# Altium schematic sheet [PCICARD]-PCI-PADS-Ax-Bx.SchDoc: Connector PCI Socket
size A3; Organization: Toradex AG; Address1: Altsagenstrasse 5; Address2: Horw; Address3: 6048; Address4: Switzerland; DocumentNumber: 6; Revision: V3.2; SheetNumber: 6; SheetTotal: 14; PageSetup: Record=PageOptions|CenterHorizontal=True|CenterVertical=True|PrintScale=0.73|XCorrection=1.00|YCorrection=1.00|PrintKind=0|BorderSize=5000000|LeftOffset=0|BottomOffset=0|Orientation=2|PaperLength=1000|PaperWidth=1000|Scale=100|PaperSource=7|PrintQuality=600|MediaType=1|DitherType=10|PaperKind=A4|PrintScaleMode=1
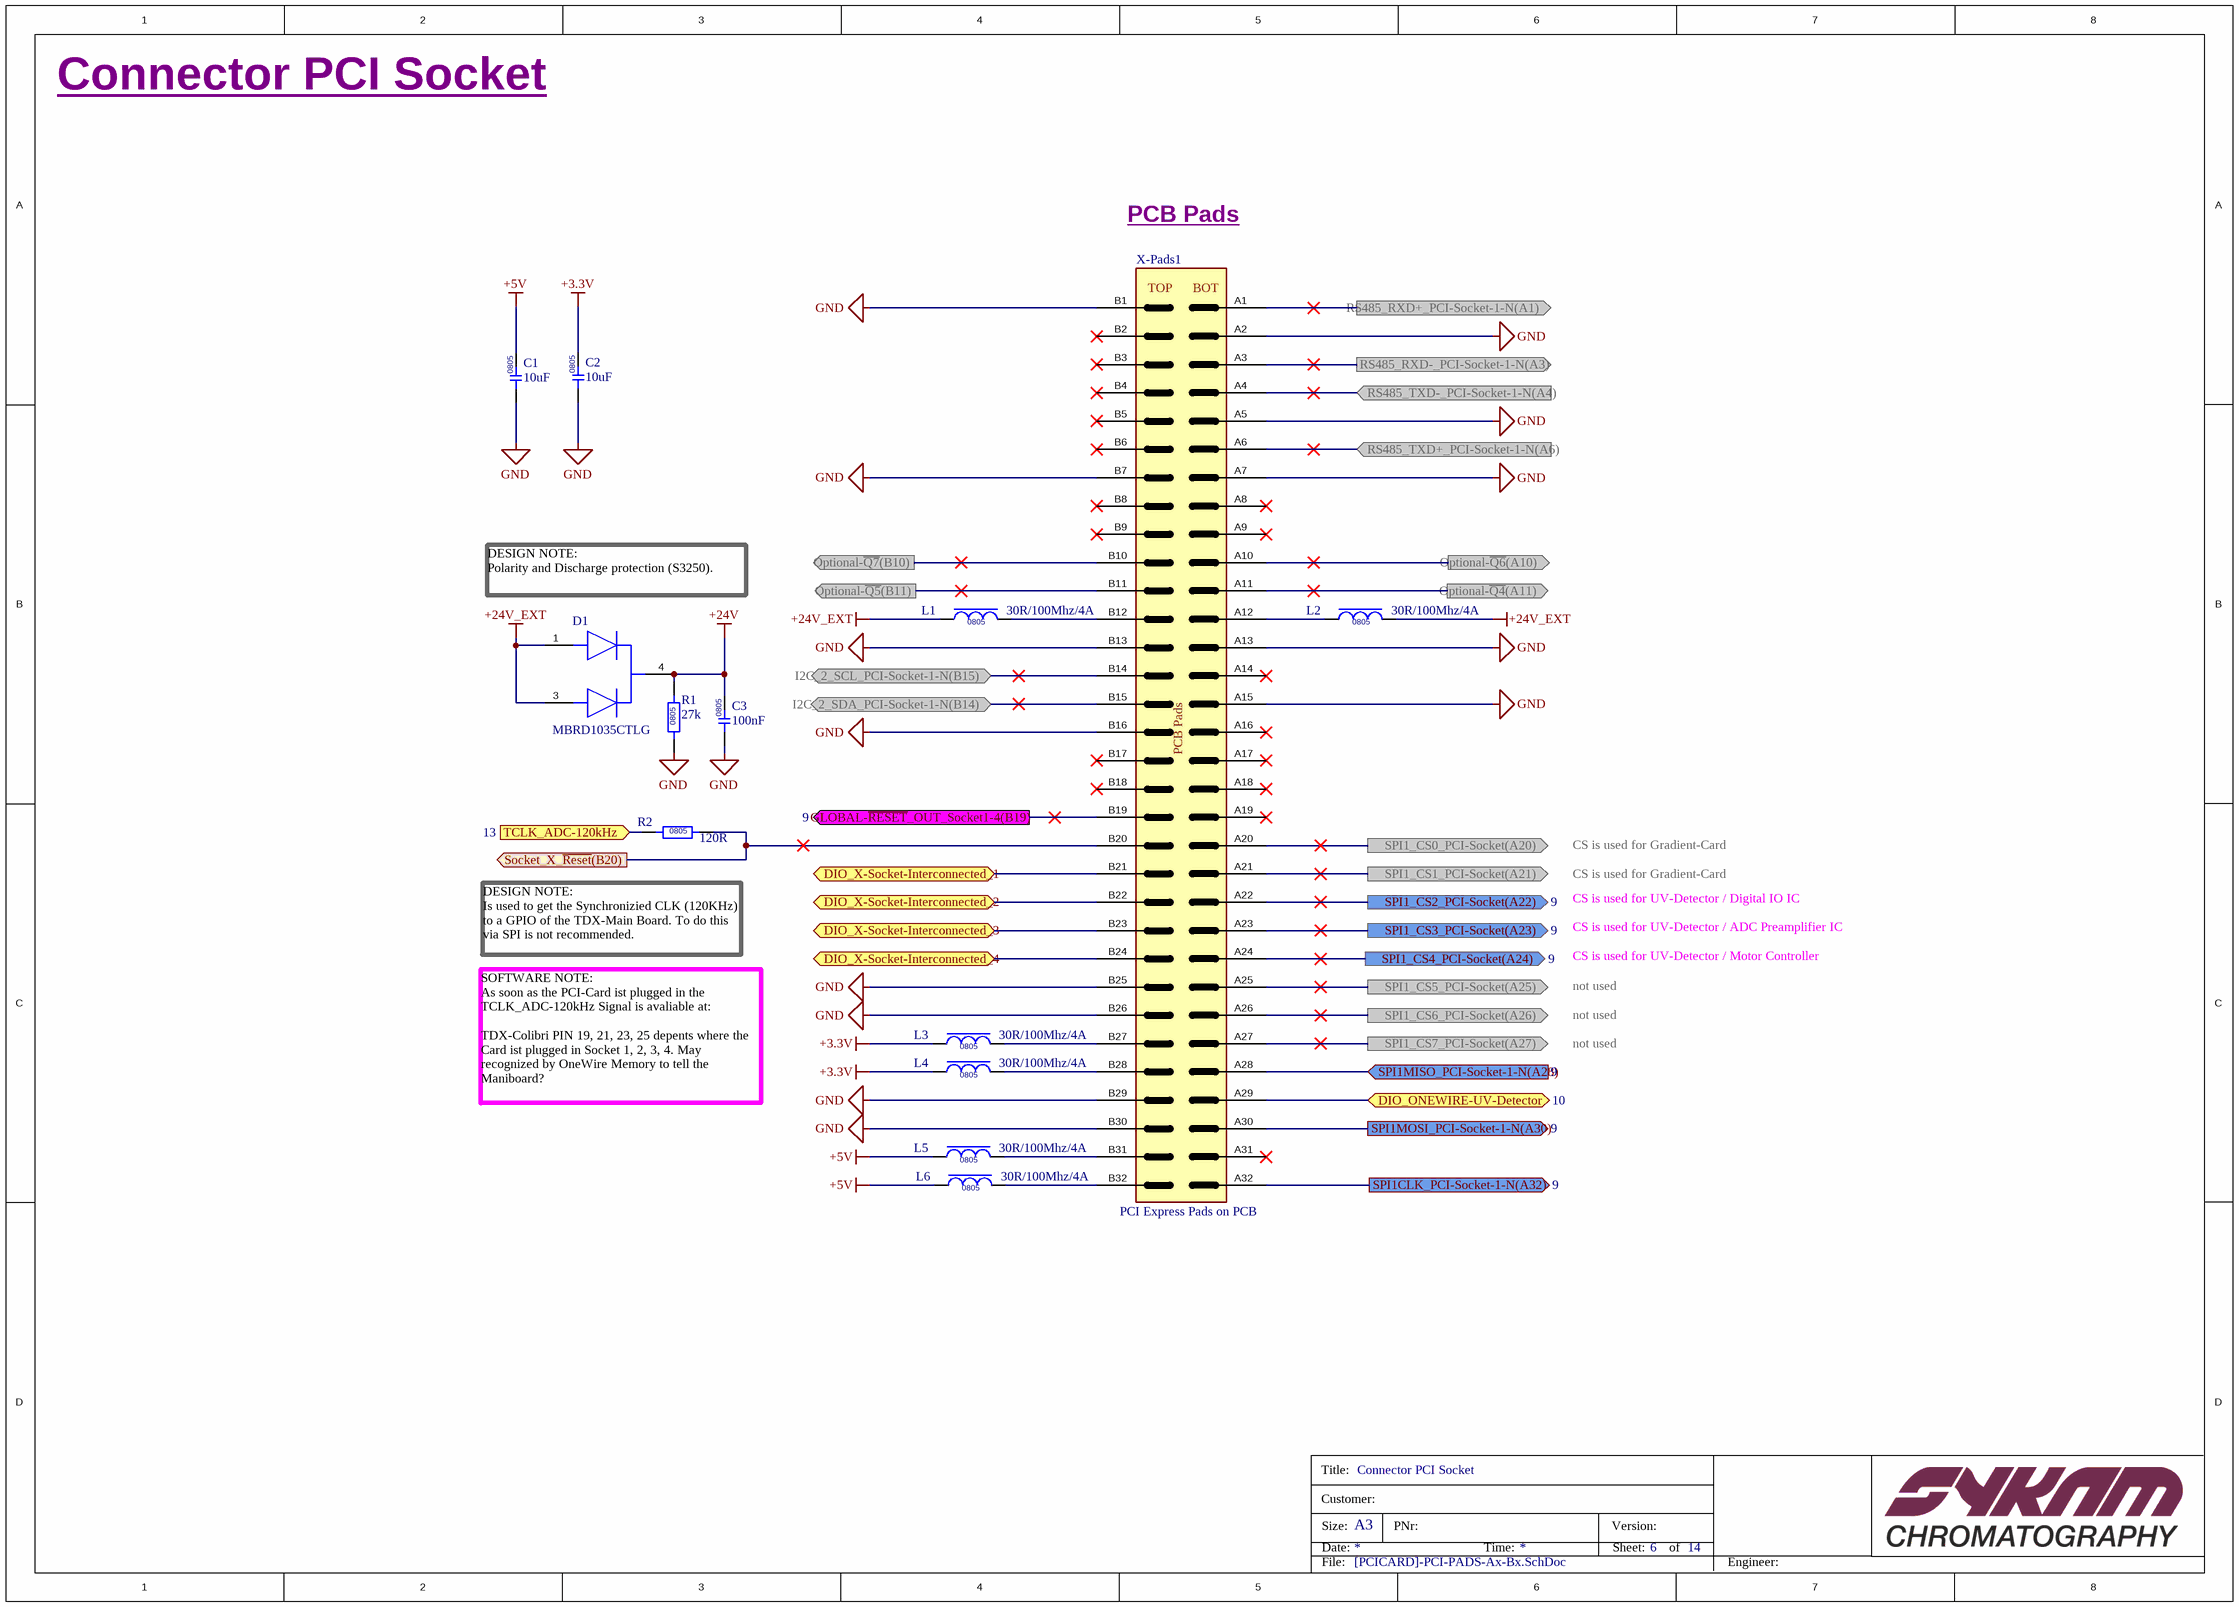
[diagram p0: [PCICARD]-PCI-PADS-Ax-Bx.SchDoc]

## Parts
C1  10uF  [C0805]
C2  10uF  [C0805]
C3  100nF  [C0805]
D1  MBRD1035CTLG  [MBRD1035CTLG-DPak]
L1  30R/100Mhz/4A  [L0805]
L2  30R/100Mhz/4A  [L0805]
L3  30R/100Mhz/4A  [L0805]
L4  30R/100Mhz/4A  [L0805]
L5  30R/100Mhz/4A  [L0805]
L6  30R/100Mhz/4A  [L0805]
R1  27k  [R0805]
R2  120R  [R0805]
X-Pads1  PCI Express Pads on PCB  [PCI_Express_64_Pads]  (no BOM)

## Ports
DIO_ONEWIRE-UV-Detector (bidir, see 10), DIO_X-Socket-Interconnected_1 (bidir), DIO_X-Socket-Interconnected_2 (bidir), DIO_X-Socket-Interconnected_3 (bidir), DIO_X-Socket-Interconnected_4 (bidir), GLOBAL-~{RESET}_OUT_Socket1-4(B19) (out, see 9), I2C_2_SCL_PCI-Socket-1-N(B15) (bidir), I2C_2_SDA_PCI-Socket-1-N(B14) (bidir), Optional-~{Q4}(A11) (out), Optional-~{Q5}(B11) (out), Optional-~{Q6}(A10) (out), Optional-~{Q7}(B10) (out), RS485_RXD+_PCI-Socket-1-N(A1) (out), RS485_RXD-_PCI-Socket-1-N(A3) (out), RS485_TXD+_PCI-Socket-1-N(A6) (in), RS485_TXD-_PCI-Socket-1-N(A4) (in), Socket_X_~{Reset}(B20) (out), SPI1_CS0_PCI-Socket(A20) (out), SPI1_CS1_PCI-Socket(A21) (out), SPI1_CS2_PCI-Socket(A22) (out, see 9), SPI1_CS3_PCI-Socket(A23) (out, see 9), SPI1_CS4_PCI-Socket(A24) (out, see 9), SPI1_CS5_PCI-Socket(A25) (out), SPI1_CS6_PCI-Socket(A26) (out), SPI1_CS7_PCI-Socket(A27) (out), SPI1CLK_PCI-Socket-1-N(A32) (out, see 9), SPI1MISO_PCI-Socket-1-N(A28) (in, see 9), SPI1MOSI_PCI-Socket-1-N(A30) (out, see 9), TCLK_ADC-120kHz (in, see 13)

## Nets
+3.3V: C2.2 L3.1 L4.1
+5V: C1.2 L5.1 L6.1
+24V: C3.2 D1.4(C) R1.2
+24V_EXT: D1.1(A) D1.3(A) L1.1 L2.2
GND: C1.1 C2.1 C3.1 R1.1 X-Pads1.A2 X-Pads1.A5 X-Pads1.A7 X-Pads1.A13 X-Pads1.A15 X-Pads1.B1 X-Pads1.B7 X-Pads1.B13 X-Pads1.B16 X-Pads1.B25(B) X-Pads1.B26(B) X-Pads1.B29(B) X-Pads1.B30(B)
DIO_ONEWIRE-UV-Detector: X-Pads1.A29(A) ; port DIO_ONEWIRE-UV-Detector
DIO_X-Socket-Interconnected_1: X-Pads1.B21(B) ; port DIO_X-Socket-Interconnected_1
DIO_X-Socket-Interconnected_2: X-Pads1.B22(B) ; port DIO_X-Socket-Interconnected_2
DIO_X-Socket-Interconnected_3: X-Pads1.B23(B) ; port DIO_X-Socket-Interconnected_3
DIO_X-Socket-Interconnected_4: X-Pads1.B24(B) ; port DIO_X-Socket-Interconnected_4
GLOBAL-~{RESET}_OUT_Socket1-4(B19): X-Pads1.B19(B) ; port GLOBAL-~{RESET}_OUT_Socket1-4(B19)
I2C_2_SCL_PCI-Socket-1-N(B15): X-Pads1.B14 ; port I2C_2_SCL_PCI-Socket-1-N(B15)
I2C_2_SDA_PCI-Socket-1-N(B14): X-Pads1.B15 ; port I2C_2_SDA_PCI-Socket-1-N(B14)
Optional-~{Q4}(A11): X-Pads1.A11 ; port Optional-~{Q4}(A11)
Optional-~{Q5}(B11): X-Pads1.B11 ; port Optional-~{Q5}(B11)
Optional-~{Q6}(A10): X-Pads1.A10 ; port Optional-~{Q6}(A10)
Optional-~{Q7}(B10): X-Pads1.B10 ; port Optional-~{Q7}(B10)
RS485_RXD+_PCI-Socket-1-N(A1): X-Pads1.A1 ; port RS485_RXD+_PCI-Socket-1-N(A1)
RS485_RXD-_PCI-Socket-1-N(A3): X-Pads1.A3 ; port RS485_RXD-_PCI-Socket-1-N(A3)
RS485_TXD+_PCI-Socket-1-N(A6): X-Pads1.A6 ; port RS485_TXD+_PCI-Socket-1-N(A6)
RS485_TXD-_PCI-Socket-1-N(A4): X-Pads1.A4 ; port RS485_TXD-_PCI-Socket-1-N(A4)
Socket_X_~{Reset}(B20): R2.2 X-Pads1.B20(B) ; port Socket_X_~{Reset}(B20)
SPI1_CS0_PCI-Socket(A20): X-Pads1.A20(A) ; port SPI1_CS0_PCI-Socket(A20)
SPI1_CS1_PCI-Socket(A21): X-Pads1.A21(A) ; port SPI1_CS1_PCI-Socket(A21)
SPI1_CS2_PCI-Socket(A22): X-Pads1.A22(A) ; port SPI1_CS2_PCI-Socket(A22)
SPI1_CS3_PCI-Socket(A23): X-Pads1.A23(A) ; port SPI1_CS3_PCI-Socket(A23)
SPI1_CS4_PCI-Socket(A24): X-Pads1.A24(A) ; port SPI1_CS4_PCI-Socket(A24)
SPI1_CS5_PCI-Socket(A25): X-Pads1.A25(A) ; port SPI1_CS5_PCI-Socket(A25)
SPI1_CS6_PCI-Socket(A26): X-Pads1.A26(A) ; port SPI1_CS6_PCI-Socket(A26)
SPI1_CS7_PCI-Socket(A27): X-Pads1.A27(A) ; port SPI1_CS7_PCI-Socket(A27)
SPI1CLK_PCI-Socket-1-N(A32): X-Pads1.A32(A) ; port SPI1CLK_PCI-Socket-1-N(A32)
SPI1MISO_PCI-Socket-1-N(A28): X-Pads1.A28(A) ; port SPI1MISO_PCI-Socket-1-N(A28)
SPI1MOSI_PCI-Socket-1-N(A30): X-Pads1.A30(A) ; port SPI1MOSI_PCI-Socket-1-N(A30)
TCLK_ADC-120kHz: R2.1 ; port TCLK_ADC-120kHz
NetL1_2: L1.2 X-Pads1.B12
NetL2_1: L2.1 X-Pads1.A12
NetL3_2: L3.2 X-Pads1.B27(B)
NetL4_2: L4.2 X-Pads1.B28(B)
NetL5_2: L5.2 X-Pads1.B31(B)
NetL6_2: L6.2 X-Pads1.B32(B)

Not connected (* = marked no-connect by the designer): X-Pads1 A8* A9* A14* A16* A17* A18* A19(A)* A31(A)* B2* B3* B4* B5* B6* B8* B9* B17* B18*

## Notes on the sheet
- PCB Pads
- (near D1) DESIGN NOTE:
  Polarity and Discharge protection (S3250).
- CS is used for Gradient-Card
- CS is used for UV-Detector / Digital IO IC
- (near R2) DESIGN NOTE:
  Is used to get the Synchronizied CLK (120KHz) to a GPIO of the TDX-Main Board. To do this via SPI is not recommended.
- CS is used for UV-Detector / ADC Preamplifier IC
- CS is used for UV-Detector / Motor Controller
- not used
- SOFTWARE NOTE:
  As soon as the PCI-Card ist plugged in the TCLK_ADC-120kHz Signal is avaliable at:
  TDX-Colibri PIN 19, 21, 23, 25 depents where the Card ist plugged in Socket 1, 2, 3, 4. May recognized by OneWire Memory to tell the Maniboard?
- Title:
- Customer:
- Size:
- Date:
- A3
- PNr:
- Time:
- Version:
- Sheet:
- of
- File:
- Engineer:
- Title
- Number:
- Revision:
- Sheet
- (in symbol PCI_Connector_64PINs_AB) TOP; BOT; PCB Pads

## Library data of the parts
C1 C2 = C_10uF_GRM21BR6YA106ME43L: 0805 10 uF 50 V ±20% Tolerance X5R Multilayer Ceramic Capacitor; Manufacturer: Murata; Voltage Rating: 35V; Supplier 1: Digi-Key; Manufacturer Part Number: GRM21BR6YA106ME43L; RoHS: Yes; Category: Ceramic Capacitors; Stock 1: 143980; Pricing 1: 1=0,48000, 10=0,33200, 100=0,19920, 500=0,14942, 1000=0,12617 (USD); Mount: Surface Mount; Case/Package: 0805; Weight: 0.000335oz; Case Code (Imperial): 0805; Case Code (Metric): 2012; Min Operating Temperature: -55°C; Max Operating Temperature: 85°C; Tolerance: 20%; Capacitance: 10uF; Packaging: Tape and Reel; Dielectric: X5R; Termination: SMD/SMT; Voltage Rating (DC): 35V; Package Quantity: 3000; Length: 0.079inch; Height: 1.25mm; Width: 0.049inch; Thickness: 0.057inch; ComponentLink1URL: http://www.mouser.com/ds/2/281/c02e-2905.pdf?src-supplier=Mouser; ComponentLink1Description: http://www.mouser.com/ds/2/281/c02e-2905.pdf?src-supplier=Mouser; ComponentLink2URL: http://search.murata.co.jp/Ceramy/image/img/A01X/G101/ENG/GRM21BR6YA106ME43-01.pdf?src-supplier=Digi-Key; ComponentLink2Description: http://search.murata.co.jp/Ceramy/image/img/A01X/G101/ENG/GRM21BR6YA106ME43-01.pdf?src-supplier=Digi-Key; Supplier Part Number 1: 490-10515-6-ND
C3 = C_100nF_CC0805KRX7R9BB104: CAP CER 0.1UF 50V X7R 0805; Manufacturer: Yageo; Material: Ceramic; Tolerance: 10%; Insulation Resistance: 100GR; PCBChecked: initials after Checked; Supplier 1: Digi-Key; Manufacturer Part Number: CC0805KRX7R9BB104; RoHS: Yes; Category: Ceramic Capacitors; Mount: Surface Mount; Case/Package: 0805; Number of Pins: 2; Case Code (Metric): 2012; Case Code (Imperial): 0805; Min Operating Temperature: -55°C; Max Operating Temperature: 125°C; Packaging: Tape and Reel; Capacitance: 100nF; Voltage Rating: 50V; Package Quantity: 1; Dielectric: X7R; Termination: SMD/SMT; Voltage: 50V; Length: 2mm; Height: 0.85mm; Width: 0.049inch; Thickness: 0.033inch; Depth: 1.25mm; Radiation Hardening: No; REACH SVHC: No SVHC; Lead Free: Lead Free; Halogen Free: Halogen Free; ComponentLink1URL: https://datasheet.ciiva.com/11786/0900766b80d84f1d-11786009.pdf?src-supplier=RSComponents; ComponentLink1Description: https://datasheet.ciiva.com/11786/0900766b80d84f1d-11786009.pdf?src-supplier=RSComponents; ComponentLink2URL: https://datasheet.ciiva.com/11464/upy-gphc-x7r-6-3v-to-50v-8-11464757.pdf?src-supplier=Avnet; ComponentLink2Description: https://datasheet.ciiva.com/11464/upy-gphc-x7r-6-3v-to-50v-8-11464757.pdf?src-supplier=Avnet; ComponentLink3URL: https://datasheet.ciiva.com/28450/1489800-28450805.pdf?src-supplier=Element14; ComponentLink3Description: https://datasheet.ciiva.com/28450/1489800-28450805.pdf?src-supplier=Element14; ComponentLink4URL: https://datasheet.ciiva.com/155/mlccorderingcode-155929.pdf?src-supplier=Digi-Key; ComponentLink4Description: https://datasheet.ciiva.com/155/mlccorderingcode-155929.pdf?src-supplier=Digi-Key; ComponentLink5URL: https://datasheet.ciiva.com/155/mlccorderingcode-155930.pdf?src-supplier=Digi-Key; ComponentLink5Description: https://datasheet.ciiva.com/155/mlccorderingcode-155930.pdf?src-supplier=Digi-Key; ComponentLink6URL: https://datasheet.ciiva.com/155/mlccorderingcode-155931.pdf?src-supplier=Digi-Key; ComponentLink6Description: https://datasheet.ciiva.com/155/mlccorderingcode-155931.pdf?src-supplier=Digi-Key; ComponentLink7URL: https://datasheet.ciiva.com/46393/1734573-46393307.pdf?src-supplier=Element14; ComponentLink7Description: https://datasheet.ciiva.com/46393/1734573-46393307.pdf?src-supplier=Element14; ComponentLink8URL: https://datasheet.ciiva.com/16625/upy-gphc-x7r-6-3v-to-50v-8-16625549.pdf?src-supplier=Avnet+Europe; ComponentLink8Description: https://datasheet.ciiva.com/16625/upy-gphc-x7r-6-3v-to-50v-8-16625549.pdf?src-supplier=Avnet+Europe; ComponentLink9URL: https://datasheet.ciiva.com/29242/445210-da-01-en-kerko-chip-0805-x7r-0-1uf-10proz-50vg-29242074.pdf?src-supplier=Conrad; ComponentLink9Description: https://datasheet.ciiva.com/29242/445210-da-01-en-kerko-chip-0805-x7r-0-1uf-10proz-50vg-29242074.pdf?src-supplier=Conrad; Supplier Part Number 1: 311-1140-6-ND; Stock 1: 7118979; IPC7352C: done; SCHChecked: Initials after checked
D1 = D_MBRD1035CTLG: ON Semi MBRD1035CTLG; Dual SMT Schottky Diode; Common Cathode; 35V 10A; 3-Pin D-PAK; Manufacturer: ON Semiconductor; Forward Voltage: 560mV; Max Surge Current: 50A; Max Reverse Current: 2mA; Average Rectified Current: 5A; Supplier 1: Farnell; Manufacturer Part Number: MBRD1035CTLG; RoHS: Yes; Category: Schottky Diodes; Stock 1: 3024; Pricing 1: 1=0,94900, 10=0,77000, 100=0,51400, 500=0,44900, 1000=0,35500, 5000=0,34900 (EUR); Case/Package: DPAK; Number of Pins: 3; Contact Plating: Tin,Matte; Min Operating Temperature: -55°C; Max Operating Temperature: 150°C; Forward Current: 10A; Package Quantity: 75; Element Configuration: Common Cathode; Packaging: Rail/Tube; Max Reverse Leakage Current: 2mA; Peak Non-Repetitive Surge Current: 50A; Max Repetitive Reverse Voltage (Vrrm): 35V; Max Forward Surge Current (Ifsm): 50A; Current Rating: 10A; Voltage Rating (DC): 35V; Max Reverse Voltage (DC): 35V; Length: 6.73mm; Width: 6.22mm; Height: 2.38mm; Radiation Hardening: No; REACH SVHC: No SVHC; Lead Free: Lead Free; Halogen Free: Halogen Free; ComponentLink1URL: https://datasheet.ciiva.com/15144/getdatasheetpartid-89397-15144640.pdf?src-supplier=Verical; ComponentLink1Description: https://datasheet.ciiva.com/15144/getdatasheetpartid-89397-15144640.pdf?src-supplier=Verical; ComponentLink2URL: https://datasheet.ciiva.com/7962/56781-7962789.pdf?src-supplier=Element14; ComponentLink2Description: https://datasheet.ciiva.com/7962/56781-7962789.pdf?src-supplier=Element14; ComponentLink3URL: https://datasheet.ciiva.com/906/mbrd1035ctl-d-906052.pdf?src-supplier=Digi-Key; ComponentLink3Description: https://datasheet.ciiva.com/906/mbrd1035ctl-d-906052.pdf?src-supplier=Digi-Key; ComponentLink4URL: https://datasheet.ciiva.com/8299/mbrd1035ctl-d-8299930.pdf?src-supplier=Avnet; ComponentLink4Description: https://datasheet.ciiva.com/8299/mbrd1035ctl-d-8299930.pdf?src-supplier=Avnet; ComponentLink5URL: https://datasheet.ciiva.com/16446/mbrd1035ctl-d-16446826.pdf?src-supplier=Future+Electronics; ComponentLink5Description: https://datasheet.ciiva.com/16446/mbrd1035ctl-d-16446826.pdf?src-supplier=Future+Electronics; Supplier Part Number 1: 9556974
L1-L6 = L_BLM21PG300SN1D_1: Ferrite Beads Multi-Layer 30Ohm 100MHz 4A 14mOhm DCR 0805 T/R; Manufacturer: Murata; Material: Steel,Ferrite; Resistance: 15mR; Tolerance: 25%; Impedance: 30R; Shielding: Unshielded; Number of Circuits: 1; DC Resistance (DCR): 14mR; Max DC Current: 3A; PCBChecked: initials after Checked; Supplier 1: Digi-Key; Manufacturer Part Number: BLM21PG300SN1D; RoHS: Yes; Category: Ferrite Beads and Chips; Case/Package: 0805; Number of Pins: 2; Core Material: Ferrite; Case Code (Metric): 2012; Case Code (Imperial): 0805; Min Operating Temperature: -55°C; Max Operating Temperature: 125°C; Frequency: 100MHz; Packaging: Tape and Reel; Package Quantity: 1; Max Current Rating: 4A; Number of Lines: 1; Termination: SMD/SMT; Test Frequency: 100MHz; DC Current: 3A; Military Standard: Not; Current Rating: 4A; Length: 2mm; Height: 0.85mm; Width: 1.25mm; Depth: 1.25mm; Radiation Hardening: No; Lead Free: Lead Free; REACH SVHC: No SVHC; ComponentLink1URL: https://datasheet.ciiva.com/11795/0900766b80021a8e-11795584.pdf?src-supplier=RSComponents; ComponentLink1Description: https://datasheet.ciiva.com/11795/0900766b80021a8e-11795584.pdf?src-supplier=RSComponents; ComponentLink2URL: https://datasheet.ciiva.com/19460/1845339-19460237.pdf?src-supplier=Jameco; ComponentLink2Description: https://datasheet.ciiva.com/19460/1845339-19460237.pdf?src-supplier=Jameco; ComponentLink3URL: https://datasheet.ciiva.com/25903/l0110s0100blm21p-25903510.pdf?src-supplier=Avnet+Europe; ComponentLink3Description: https://datasheet.ciiva.com/25903/l0110s0100blm21p-25903510.pdf?src-supplier=Avnet+Europe; ComponentLink4URL: https://datasheet.ciiva.com/3081/l0110s0100blm21p-3081657.pdf?src-supplier=Avnet; ComponentLink4Description: https://datasheet.ciiva.com/3081/l0110s0100blm21p-3081657.pdf?src-supplier=Avnet; ComponentLink5URL: https://datasheet.ciiva.com/16199/l0110s0100blm21p-16199625.pdf?src-supplier=Future+Electronics; ComponentLink5Description: https://datasheet.ciiva.com/16199/l0110s0100blm21p-16199625.pdf?src-supplier=Future+Electronics; ComponentLink6URL: https://datasheet.ciiva.com/3081/l0110s0100blm21p-3081658.pdf?src-supplier=Avnet; ComponentLink6Description: https://datasheet.ciiva.com/3081/l0110s0100blm21p-3081658.pdf?src-supplier=Avnet; ComponentLink7URL: https://datasheet.ciiva.com/6212/l0110s0100blm21p-6212358.pdf?src-supplier=Digi-Key; ComponentLink7Description: https://datasheet.ciiva.com/6212/l0110s0100blm21p-6212358.pdf?src-supplier=Digi-Key; ComponentLink8URL: https://datasheet.ciiva.com/6212/l0110s0100blm21p-6212360.pdf?src-supplier=Digi-Key; ComponentLink8Description: https://datasheet.ciiva.com/6212/l0110s0100blm21p-6212360.pdf?src-supplier=Digi-Key; ComponentLink9URL: https://datasheet.ciiva.com/8021/1756152-8021599.pdf?src-supplier=Element14; ComponentLink9Description: https://datasheet.ciiva.com/8021/1756152-8021599.pdf?src-supplier=Element14; ComponentLink10URL: https://datasheet.ciiva.com/41449/001172365-da-01-en-drossel-0805-30r0-2-0x1-25mm-4000st-41449606.pdf?src-supplier=Conrad; ComponentLink10Description: https://datasheet.ciiva.com/41449/001172365-da-01-en-drossel-0805-30r0-2-0x1-25mm-4000st-41449606.pdf?src-supplier=Conrad; Supplier Part Number 1: 490-1052-1-ND; Stock 1: 88452; IPC7352C: done; SCHChecked: Initials after checked
R1 = R_27k_RC0805FR-0727KL: Surface Mount Thick Film Resistor, RC Series, 27 kohm, 125 mW, - 1%, 150 V, 0805 [2012 Metric]; Manufacturer: Yageo; Resistance: 27kR; Temperature Coefficient: 100ppm/°C; Power Rating: 125mW; Voltage Rating: 150V; Supplier 1: Digi-Key; Manufacturer Part Number: RC0805FR-0727KL; RoHS: Yes; Category: Chip SMD Resistors; Stock 1: 307907; Pricing 1: 1=0,10000, 10=0,04000, 100=0,01630, 1000=0,00731, 2500=0,00635 (USD); Case/Package: 0805; Case Code (Metric): 2012; Case Code (Imperial): 0805; Min Operating Temperature: -55°C; Max Operating Temperature: 155°C; Tolerance: 1%; Composition: Thick Film; Packaging: Tape and Reel; Package Quantity: 1; Number of Terminations: 2; Termination: SMD/SMT; Military Standard: Not; Max Power Dissipation: 125mW; Features: Moisture Resistant; Length: 2mm; Height: 0.5mm; Width: 0.049inch; Depth: 1.25mm; Lead Free: Lead Free; REACH SVHC: Unknown; ComponentLink1URL: https://datasheet.ciiva.com/11809/0900766b8106beab-11809381.pdf?src-supplier=RSComponents; ComponentLink1Description: https://datasheet.ciiva.com/11809/0900766b8106beab-11809381.pdf?src-supplier=RSComponents; ComponentLink2URL: https://datasheet.ciiva.com/2457/pyu-r-int-thick-7-2457986.pdf?src-supplier=Digi-Key; ComponentLink2Description: https://datasheet.ciiva.com/2457/pyu-r-int-thick-7-2457986.pdf?src-supplier=Digi-Key; ComponentLink3URL: https://datasheet.ciiva.com/2457/pyu-r-int-thick-7-2457988.pdf?src-supplier=Digi-Key; ComponentLink3Description: https://datasheet.ciiva.com/2457/pyu-r-int-thick-7-2457988.pdf?src-supplier=Digi-Key; ComponentLink4URL: https://datasheet.ciiva.com/7941/444164-7941751.pdf?src-supplier=Element14; ComponentLink4Description: https://datasheet.ciiva.com/7941/444164-7941751.pdf?src-supplier=Element14; ComponentLink5URL: https://datasheet.ciiva.com/2457/pyu-r-int-thick-7-2457987.pdf?src-supplier=Digi-Key; ComponentLink5Description: https://datasheet.ciiva.com/2457/pyu-r-int-thick-7-2457987.pdf?src-supplier=Digi-Key; ComponentLink6URL: https://datasheet.ciiva.com/7941/444164-7941750.pdf?src-supplier=Element14; ComponentLink6Description: https://datasheet.ciiva.com/7941/444164-7941750.pdf?src-supplier=Element14; Supplier Part Number 1: 311-27.0KCRCT-ND
R2 = R_120R_RC0805FR-07120RL: RES SMD 120 OHM 1% 1/8W 0805; Manufacturer: Yageo; Temperature Coefficient: 100ppm/°C; Power Rating: 125mW; Voltage Rating: 150V; PCBChecked: initials after Checked; Supplier 1: Digi-Key; Manufacturer Part Number: RC0805FR-07120RL; RoHS: Yes; Category: Chip SMD Resistors; Case/Package: 0805; Case Code (Metric): 2012; Case Code (Imperial): 0805; Min Operating Temperature: -55°C; Max Operating Temperature: 155°C; Resistance: 120R; Tolerance: 1%; Packaging: Tape and Reel; Composition: Thick Film; Package Quantity: 1; Number of Terminations: 2; Termination: SMD/SMT; Military Standard: Not; Max Power Dissipation: 125mW; Features: Moisture Resistant; Length: 2mm; Height: 0.5mm; Width: 0.049inch; Depth: 1.25mm; REACH SVHC: Unknown; Lead Free: Lead Free; ComponentLink1URL: https://datasheet.ciiva.com/11819/0900766b8106beab-11819786.pdf?src-supplier=RSComponents; ComponentLink1Description: https://datasheet.ciiva.com/11819/0900766b8106beab-11819786.pdf?src-supplier=RSComponents; ComponentLink2URL: https://datasheet.ciiva.com/2491/pyu-r-int-thick-7-2491586.pdf?src-supplier=Digi-Key; ComponentLink2Description: https://datasheet.ciiva.com/2491/pyu-r-int-thick-7-2491586.pdf?src-supplier=Digi-Key; ComponentLink3URL: https://datasheet.ciiva.com/7941/444164-7941691.pdf?src-supplier=Element14; ComponentLink3Description: https://datasheet.ciiva.com/7941/444164-7941691.pdf?src-supplier=Element14; ComponentLink4URL: https://datasheet.ciiva.com/16964/rc0805-16964606.pdf?src-supplier=Future+Electronics; ComponentLink4Description: https://datasheet.ciiva.com/16964/rc0805-16964606.pdf?src-supplier=Future+Electronics; ComponentLink5URL: https://datasheet.ciiva.com/2491/pyu-r-int-thick-7-2491585.pdf?src-supplier=Digi-Key; ComponentLink5Description: https://datasheet.ciiva.com/2491/pyu-r-int-thick-7-2491585.pdf?src-supplier=Digi-Key; ComponentLink6URL: https://datasheet.ciiva.com/2491/pyu-r-int-thick-7-2491587.pdf?src-supplier=Digi-Key; ComponentLink6Description: https://datasheet.ciiva.com/2491/pyu-r-int-thick-7-2491587.pdf?src-supplier=Digi-Key; ComponentLink7URL: https://datasheet.ciiva.com/12558/rc0805-257173-12558661.pdf?src-supplier=Mouser; ComponentLink7Description: https://datasheet.ciiva.com/12558/rc0805-257173-12558661.pdf?src-supplier=Mouser; ComponentLink8URL: https://datasheet.ciiva.com/7941/444164-7941692.pdf?src-supplier=Element14; ComponentLink8Description: https://datasheet.ciiva.com/7941/444164-7941692.pdf?src-supplier=Element14; Supplier Part Number 1: 311-120CRCT-ND; Stock 1: 633913; IPC7352C: done; SCHChecked: Initials after checked
X-Pads1 = PCI_Connector_64PINs_AB